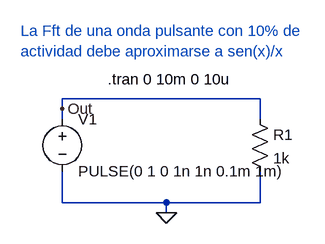
[diagram p0: schematic Fft.asc]
Fft.asc, the LTspice schematic file:
Version 4
SHEET 1 880 680
WIRE -64 160 -64 144
WIRE -64 176 -64 160
WIRE -64 304 -64 256
WIRE 96 304 -64 304
WIRE 96 320 96 304
WIRE 240 144 -64 144
WIRE 240 176 240 144
WIRE 240 304 96 304
WIRE 240 304 240 256
FLAG 96 320 0
FLAG -64 160 Out
SYMBOL voltage -64 160 R0
WINDOW 123 0 0 Left 0
WINDOW 39 0 0 Left 0
SYMATTR InstName V1
SYMATTR Value PULSE(0 1 0 1n 1n 0.1m 1m)
SYMBOL res 224 160 R0
SYMATTR InstName R1
SYMATTR Value 1k
TEXT 6 114 Left 0 !.tran 0 10m 0 10u
TEXT -128 40 Left 0 ;La Fft de una onda pulsante con 10% de\nactividad debe aproximarse a sen(x)/x

The netlist it stands for:
* Fft.asc
V1 Out 0 PULSE(0 1 0 1n 1n 0.1m 1m)
R1 Out 0 1k
.tran 0 10m 0 10u
* La Fft de una onda pulsante con 10% de
* actividad debe aproximarse a sen(x)/x
.backanno
.end